# Altium project PuttPilot-Master.PrjPcb (part 2 of 4)

## Sheet ESP-Power.SchDoc: ESP Power
size 279 x 215 mm; DrawnBy: Ethan Abraham; Engineer: Ethan Abraham; Revision: 1.0; SheetNumber: 4; SheetTotal: 7
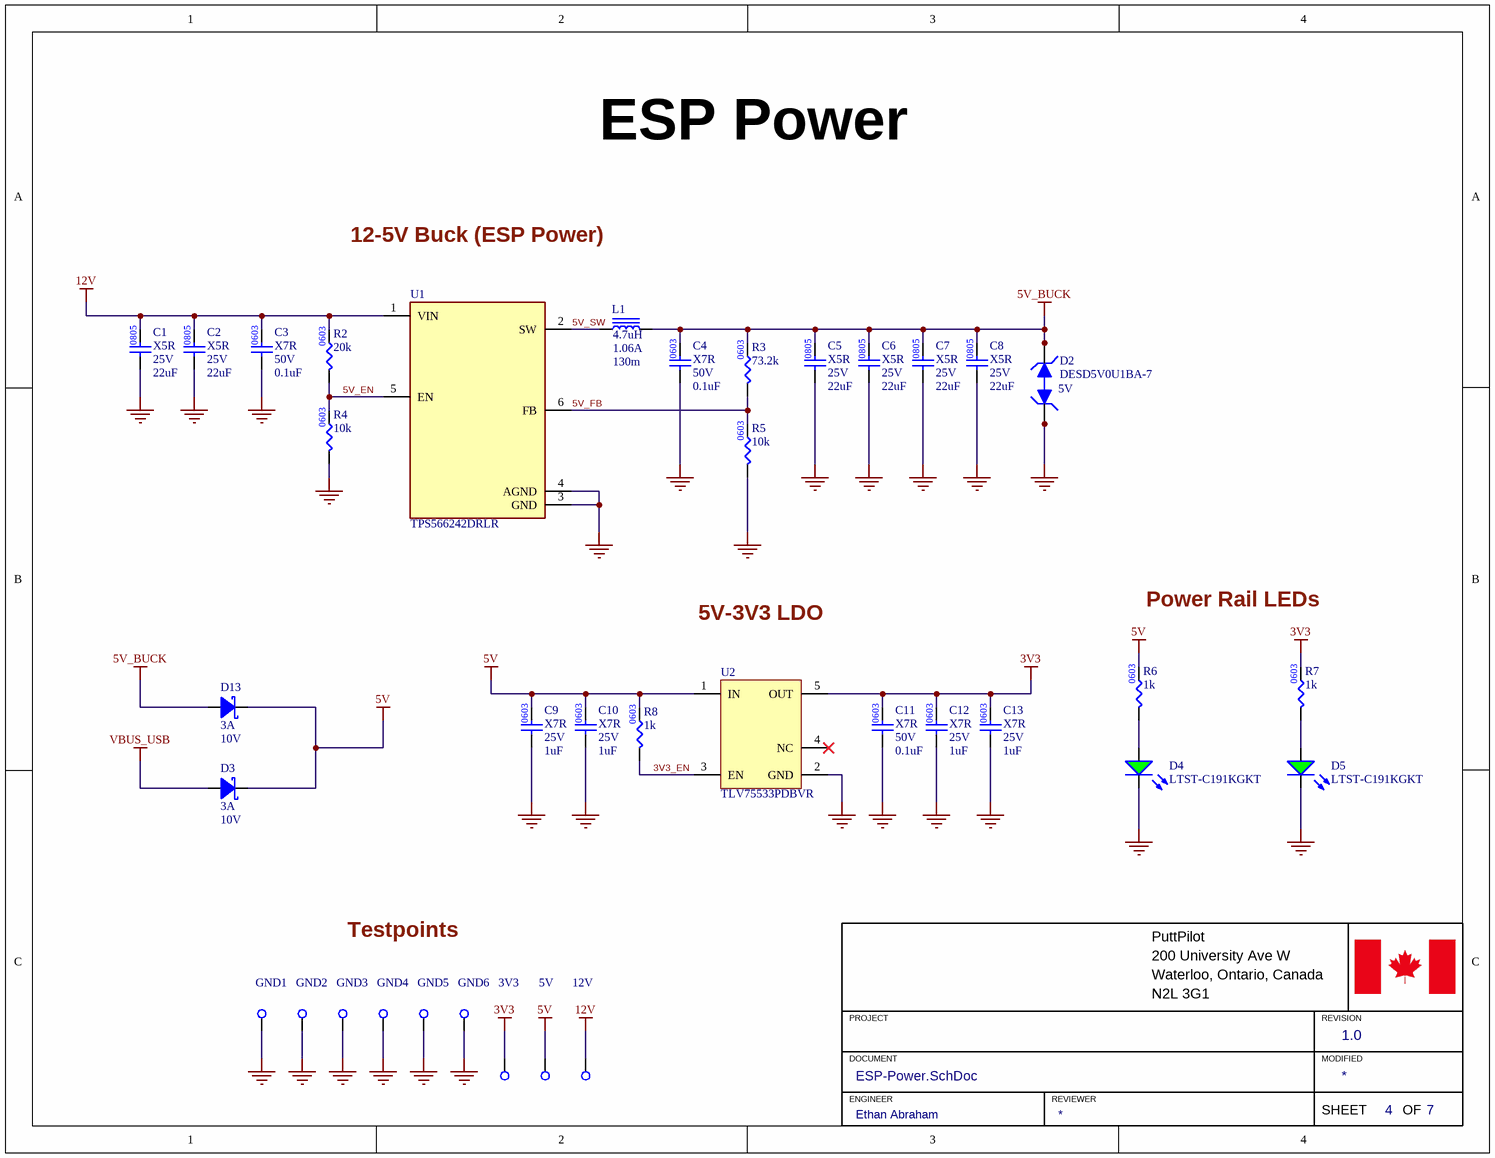
[diagram p4: ESP-Power.SchDoc]

### Parts
3V3  RCWCTE  [RCWCTE]  (value not drawn)
5V  RCWCTE  [RCWCTE]  (value not drawn)
12V  RCWCTE  [RCWCTE]  (value not drawn)
C1  Temperature Characteristics Code: X5R  Rated DC Voltage (URdc): 25V  Capacitance: 22uF  [.CAP_0805]  (hidden comment: GRM21BR61E226ME44K)
C2  Temperature Characteristics Code: X5R  Rated DC Voltage (URdc): 25V  Capacitance: 22uF  [.CAP_0805]  (hidden comment: GRM21BR61E226ME44K)
C3  Temperature Characteristics Code: X7R  Rated DC Voltage (URdc): 50V  Capacitance: 0.1uF  [.CAP_0603]  (hidden comment: GCJ188R71H104KA12D)
C4  Temperature Characteristics Code: X7R  Rated DC Voltage (URdc): 50V  Capacitance: 0.1uF  [.CAP_0603]  (hidden comment: GCJ188R71H104KA12D)
C5  Temperature Characteristics Code: X5R  Rated DC Voltage (URdc): 25V  Capacitance: 22uF  [.CAP_0805]  (hidden comment: GRM21BR61E226ME44K)
C6  Temperature Characteristics Code: X5R  Rated DC Voltage (URdc): 25V  Capacitance: 22uF  [.CAP_0805]  (hidden comment: GRM21BR61E226ME44K)
C7  Temperature Characteristics Code: X5R  Rated DC Voltage (URdc): 25V  Capacitance: 22uF  [.CAP_0805]  (hidden comment: GRM21BR61E226ME44K)
C8  Temperature Characteristics Code: X5R  Rated DC Voltage (URdc): 25V  Capacitance: 22uF  [.CAP_0805]  (hidden comment: GRM21BR61E226ME44K)
C9  Temperature Characteristics Code: X7R  Rated DC Voltage (URdc): 25V  Capacitance: 1uF  [.CAP_0603]  (hidden comment: GRT188R71E105KE13D)
C10  Temperature Characteristics Code: X7R  Rated DC Voltage (URdc): 25V  Capacitance: 1uF  [.CAP_0603]  (hidden comment: GRT188R71E105KE13D)
C11  Temperature Characteristics Code: X7R  Rated DC Voltage (URdc): 50V  Capacitance: 0.1uF  [.CAP_0603]  (hidden comment: GCJ188R71H104KA12D)
C12  Temperature Characteristics Code: X7R  Rated DC Voltage (URdc): 25V  Capacitance: 1uF  [.CAP_0603]  (hidden comment: GRT188R71E105KE13D)
C13  Temperature Characteristics Code: X7R  Rated DC Voltage (URdc): 25V  Capacitance: 1uF  [.CAP_0603]  (hidden comment: GRT188R71E105KE13D)
D2  DESD5V0U1BA-7  Rep Pk Reverse Voltage-Max: 5V  [DESD5V0U1BA-7]
D3  Max Current: 3A  Max Voltage: 10V  [BAT60JFILM]  (hidden comment: BAT60JFILM)
D4  LTST-C191KGKT  [.LED_0603]
D5  LTST-C191KGKT  [.LED_0603]
D13  Max Current: 3A  Max Voltage: 10V  [BAT60JFILM]  (hidden comment: BAT60JFILM)
GND1  RCWCTE  [RCWCTE]  (value not drawn)
GND2  RCWCTE  [RCWCTE]  (value not drawn)
GND3  RCWCTE  [RCWCTE]  (value not drawn)
GND4  RCWCTE  [RCWCTE]  (value not drawn)
GND5  RCWCTE  [RCWCTE]  (value not drawn)
GND6  RCWCTE  [RCWCTE]  (value not drawn)
L1  DC Resistance (DCR): 130m  Inductance-Nom (L): 4.7uH  Rated Current-Max: 1.06A  [NRH3012T4R7MN]  (hidden comment: NRH3012T4R7MN)
R2  Resistance: 20k  [.RES_0603]  (hidden comment: ERJ-3EKF2002V)
R3  Resistance: 73.2k  [.RES_0603]  (hidden comment: RC0603FR-0773K2L)
R4  Resistance: 10k  [.RES_0603]  (hidden comment: RC0603FR-0710KL)
R5  Resistance: 10k  [.RES_0603]  (hidden comment: RC0603FR-0710KL)
R6  Resistance: 1k  [.RES_0603]  (hidden comment: RC0603FR-071KL)
R7  Resistance: 1k  [.RES_0603]  (hidden comment: RC0603FR-071KL)
R8  Resistance: 1k  [.RES_0603]  (hidden comment: RC0603FR-071KL)
U1  TPS566242DRLR  [TPS566242DRLR]
U2  TLV75533PDBVR  [.SOT-23-5]

### Nets
3V3: 3V3.1 C11.2 C12.2 C13.2 R7.2 U2.5(OUT)
5V: 5V.1 C9.2 C10.2 D3.2(Cathode) D13.2(Cathode) R6.2 R8.2 U2.1(IN)
5V_BUCK: C4.2 C5.2 C6.2 C7.2 C8.2 D2.2(Pin_2) D13.1(Anode) L1.2 R3.2
12V: 12V.1 C1.2 C2.2 C3.2 R2.2 U1.1(VIN)
GND: C1.1 C2.1 C3.1 C4.1 C5.1 C6.1 C7.1 C8.1 C9.1 C10.1 C11.1 C12.1 C13.1 D2.1(Pin_1) D4.2(K) D5.2(K) GND1.1 GND2.1 GND3.1 GND4.1 GND5.1 GND6.1 R4.1 R5.1 U1.3(GND) U1.4(AGND) U2.2(GND)
VBUS_USB: D3.1(Anode)
3V3_EN: R8.1 U2.3(EN)
5V_EN: R2.1 R4.2 U1.5(EN)
5V_FB: R3.1 R5.2 U1.6(FB)
5V_SW: L1.1 U1.2(SW)
NetD4_1: D4.1(A) R6.1
NetD5_1: D5.1(A) R7.1

Not connected (* = marked no-connect by the designer): U2 4(NC)*

### Notes on the sheet
- 12-5V Buck (ESP Power)
- 5V-3V3 LDO
- Power Rail LEDs
- Testpoints
- PuttPilot
- 200 University Ave W
- PROJECT
- Waterloo, Ontario, Canada
- N2L 3G1
- REVISION
- DOCUMENT
- ENGINEER
- REVIEWER
- MODIFIED
- SHEET
- OF

### Library data of the parts
3V3 5V 12V GND1-GND6 = RCWCTE: SMT Test Point; Manufacturer: KOA Speer; Resistance: 0R; Current Rating: 2A; Number of Contacts: 1; Supplier 1: Digikey; Manufacturer Part Number: RCWCTE; RoHS: Yes; Category: Chip SMD Resistors; Stock 1: 56953; Pricing 1: 1=0.2, 10=0.15, 25=0.1344, 50=0.1238, 100=0.1141, 250=0.10268, 500=0.09488, 1000=0.08781 (USD); Mount: Surface Mount; Case/Package: 1206; Case Code (Imperial): 1206; Case Code (Metric): 3216; Contact Material: Copper,Tin; Min Operating Temperature: -55°C; Max Operating Temperature: 125°C; Packaging: Tape and Reel; Termination: SMD/SMT; Series: RC; Length: 3.2mm; Width: 1.6mm; Height: 2mm; Depth: 1.6mm; Military Standard: Not; RoHS Compliant: Yes; ComponentLink1URL: https://datasheet.ciiva.com/34302/1876186-34302940.pdf?src-supplier=Jameco; ComponentLink1Description: https://datasheet.ciiva.com/34302/1876186-34302940.pdf?src-supplier=Jameco; ComponentLink2URL: https://datasheet.ciiva.com/5556/rc-5556236.pdf?src-supplier=Mouser; ComponentLink2Description: https://datasheet.ciiva.com/5556/rc-5556236.pdf?src-supplier=Mouser; ComponentLink3URL: https://datasheet.ciiva.com/26821/getdatasheetpartid-110197-26821157.pdf?src-supplier=Verical; ComponentLink3Description: https://datasheet.ciiva.com/26821/getdatasheetpartid-110197-26821157.pdf?src-supplier=Verical; Supplier Part Number 1: 2019-RCWCTECT-ND
C1 C2 C5-C8 = GRM21BR61E226ME44K: CAP CER 22uF 25V X5R 0805; Manufacturer: Murata; Dielectric Material: Ceramic; Multilayer: Yes; Negative Tolerance: 20%; Supplier 1: Future Electronics; Manufacturer Part Number: GRM21BR61E226ME44K; RoHS: Yes; Category: Ceramic Capacitors; Stock 1: 60000; Pricing 1: 10000=0.0684, 20000=0.0672, 30000=0.0661 (USD); Mount: Surface Mount; Number of Pins: 2; Package Shape: Rectangular; Size Code: 0805; Terminal Finish: Nickel; Min Operating Temperature: -55°C; Max Operating Temperature: 85°C; JESD-609 Code: e3; Capacitor Type: Ceramic; Package Style: SMTMeter; Packaging: Tape and Reel; Positive Tolerance: 20%; Termination: Wraparound; Length: 2mm; Width: 1.25mm; Height: 1.25mm; Reach SVHC Compliant: Yes; RoHS Compliant: Yes; ComponentLink1URL: https://datasheet.ciiva.com:443/pdfs/VipMasterIC/IC/MURE/MURE-S-A0002977178/MURE-S-A0002978778-1.pdf?src-supplier=IHS+Markit; ComponentLink1Description: https://datasheet.ciiva.com:443/pdfs/VipMasterIC/IC/MURE/MURE-S-A0002977178/MURE-S-A0002978778-1.pdf?src-supplier=IHS+Markit; ComponentLink2URL: http://www.mouser.com/ds/2/281/c02e-2905.pdf?src-supplier=Mouser; ComponentLink2Description: http://www.mouser.com/ds/2/281/c02e-2905.pdf?src-supplier=Mouser; ComponentLink3URL: https://datasheet.octopart.com/GRM21BR61E226ME44K-Murata-datasheet-155345081.pdf?src-supplier=Element14; ComponentLink3Description: https://datasheet.octopart.com/GRM21BR61E226ME44K-Murata-datasheet-155345081.pdf?src-supplier=Element14; ComponentLink4URL: http://search.murata.co.jp/Ceramy/image/img/A01X/G101/ENG/GRM21BR61E226ME44-01.pdf?src-supplier=Digikey; ComponentLink4Description: http://search.murata.co.jp/Ceramy/image/img/A01X/G101/ENG/GRM21BR61E226ME44-01.pdf?src-supplier=Digikey; ComponentLink5URL: https://search.murata.co.jp/Ceramy/image/img/A01X/G101/ENG/GRM21BR61E226ME44-01.pdf?src-supplier=Digikey; ComponentLink5Description: https://search.murata.co.jp/Ceramy/image/img/A01X/G101/ENG/GRM21BR61E226ME44-01.pdf?src-supplier=Digikey; ComponentLink6URL: https://datasheet.octopart.com/GRM21BR61E226ME44K-Murata-datasheet-99353850.pdf?src-supplier=Future+Electronics; ComponentLink6Description: https://datasheet.octopart.com/GRM21BR61E226ME44K-Murata-datasheet-99353850.pdf?src-supplier=Future+Electronics; ComponentLink7URL: https://datasheet.octopart.com/GRM21BR61E226ME44K-Murata-datasheet-155345081.pdf?src-supplier=Newark; ComponentLink7Description: https://datasheet.octopart.com/GRM21BR61E226ME44K-Murata-datasheet-155345081.pdf?src-supplier=Newark; ComponentLink8URL: https://datasheet.octopart.com/GRM21BR61E226ME44K-Murata-datasheet-165579666.pdf?src-supplier=TME; ComponentLink8Description: https://datasheet.octopart.com/GRM21BR61E226ME44K-Murata-datasheet-165579666.pdf?src-supplier=TME; Supplier Part Number 1: 1092989
C3 C4 C11 = GCJ188R71H104KA12D: CAP CER 0.1uF 50V X7R 0603; Manufacturer: Murata; Dielectric Material: Ceramic; Multilayer: Yes; Negative Tolerance: 10%; Reference Standard: AEC-Q200; Supplier 1: Future Electronics; Manufacturer Part Number: GCJ188R71H104KA12D; RoHS: Yes; Category: Ceramic Capacitors; Stock 1: 3280000; Pricing 1: 4000=0.0182, 12000=0.0178, 20000=0.0176, 80000=0.017, 120000=0.0167 (USD); Mount: Surface Mount; Number of Pins: 2; Package Shape: Rectangular; Size Code: 0603; Terminal Finish: Nickel; Min Operating Temperature: -55°C; Max Operating Temperature: 125°C; JESD-609 Code: e3; Capacitor Type: Ceramic; Package Style: SMTMeter; Packaging: Tape and Reel; Positive Tolerance: 10%; Termination: Wraparound; Length: 1.6mm; Width: 0.8mm; Height: 0.8mm; Reach SVHC Compliant: Yes; RoHS Compliant: Yes; ComponentLink1URL: https://psearch.en.murata.com:443/capacitor/product/GCJ188R71H104KA12%23.pdf?src-supplier=IHS+Markit; ComponentLink1Description: https://psearch.en.murata.com:443/capacitor/product/GCJ188R71H104KA12%23.pdf?src-supplier=IHS+Markit; ComponentLink2URL: https://datasheet.ciiva.com/135/product-135604.pdf?src-supplier=Digikey; ComponentLink2Description: https://datasheet.ciiva.com/135/product-135604.pdf?src-supplier=Digikey; ComponentLink3URL: https://datasheet.ciiva.com/26889/getdatasheetpartid-369886-26889118.pdf?src-supplier=Verical; ComponentLink3Description: https://datasheet.ciiva.com/26889/getdatasheetpartid-369886-26889118.pdf?src-supplier=Verical; ComponentLink4URL: https://datasheet.ciiva.com/135/s0717e-135605.pdf?src-supplier=Digikey; ComponentLink4Description: https://datasheet.ciiva.com/135/s0717e-135605.pdf?src-supplier=Digikey; ComponentLink5URL: https://datasheet.ciiva.com/135/s0717e-135606.pdf?src-supplier=Digikey; ComponentLink5Description: https://datasheet.ciiva.com/135/s0717e-135606.pdf?src-supplier=Digikey; ComponentLink6URL: https://datasheet.ciiva.com/16440/c03e-16440425.pdf?src-supplier=Future+Electronics; ComponentLink6Description: https://datasheet.ciiva.com/16440/c03e-16440425.pdf?src-supplier=Future+Electronics; Supplier Part Number 1: 1158604
C9 C10 C12 C13 = GRT188R71E105KE13D: CAP CER 1uF 25V X7R 0603; Manufacturer: Murata; Dielectric Material: Ceramic; Multilayer: Yes; Negative Tolerance: 10%; Reference Standard: AEC-Q200; Supplier 1: Future Electronics; Manufacturer Part Number: GRT188R71E105KE13D; RoHS: Yes; Category: Ceramic Capacitors; Stock 1: 236000; Pricing 1: 4000=0.0164, 12000=0.0158, 20000=0.0155, 80000=0.0148, 120000=0.0144 (USD); Mount: Surface Mount; Number of Pins: 2; Package Shape: Rectangular; Size Code: 0603; Terminal Finish: Nickel; Min Operating Temperature: -55°C; Max Operating Temperature: 125°C; JESD-609 Code: e3; Capacitor Type: Ceramic; Packaging: Tape and Reel; Positive Tolerance: 10%; Termination: Wraparound; Reach SVHC Compliant: Yes; RoHS Compliant: Yes; ComponentLink1URL: https://datasheet.ciiva.com:443/pdfs/VipMasterIC/IC/MURE/MURE-S-A0004410517/MURE-S-A0004413605-1.pdf?src-supplier=IHS+Markit; ComponentLink1Description: https://datasheet.ciiva.com:443/pdfs/VipMasterIC/IC/MURE/MURE-S-A0004410517/MURE-S-A0004413605-1.pdf?src-supplier=IHS+Markit; ComponentLink2URL: http://www.farnell.com/datasheets/2165962.pdf?src-supplier=Farnell; ComponentLink2Description: http://www.farnell.com/datasheets/2165962.pdf?src-supplier=Farnell; ComponentLink3URL: https://datasheet.octopart.com/GRT188R71E105KE13D-Murata-datasheet-149523601.pdf?src-supplier=Farnell; ComponentLink3Description: https://datasheet.octopart.com/GRT188R71E105KE13D-Murata-datasheet-149523601.pdf?src-supplier=Farnell; ComponentLink4URL: https://datasheet.octopart.com/GRT188R71E105KE13D-Murata-datasheet-67697754.pdf?src-supplier=Newark; ComponentLink4Description: https://datasheet.octopart.com/GRT188R71E105KE13D-Murata-datasheet-67697754.pdf?src-supplier=Newark; ComponentLink5URL: https://datasheet.octopart.com/GRT188R71E105KE13D-Murata-datasheet-165579666.pdf?src-supplier=TME; ComponentLink5Description: https://datasheet.octopart.com/GRT188R71E105KE13D-Murata-datasheet-165579666.pdf?src-supplier=TME; Supplier Part Number 1: 6183026
D2 = DESD5V0U1BA-7: TVS DIODE 5VWM; Manufacturer: Diodes; Diode Element Material: SILICON; Package Body Material: Plastic; Polarity: Bidirectional; Max Breakdown Voltage: 9.5V; Min Breakdown Voltage: 5.5V; Diode Type: TRANS VOLTAGE SUPPRESSOR; Number of Elements: 1; Max Power Dissipation: 250mW; Reference Standard: IEC-61000-4-2; Supplier 1: Future Electronics; Manufacturer Part Number: DESD5V0U1BA-7; RoHS: Yes; Category: TVS Diodes; Stock 1: 54000; Pricing 1: 3000=0.0283, 12000=0.0271, 30000=0.0263, 75000=0.0256, 120000=0.0244 (USD); Number of Pins: 2; Package Shape: Rectangular; Min Operating Temperature: -65°C; Max Operating Temperature: 150°C; JESD-30 Code: R-PDSO-G2; Package Style: SMALL OUTLINEMeter; Surface Mount: Yes; Technology: AVALANCHE; Terminal Form: Gull Wing; Terminal Position: DUAL; Reach SVHC Compliant: Yes; RoHS Compliant: Yes; ComponentLink1URL: https://datasheet.ciiva.com:443/pdfs/VipMasterIC/IC/DIOD/DIOD-S-A0002833665/DIOD-S-A0002833261-1.pdf?src-supplier=IHS+Markit; ComponentLink1Description: https://datasheet.ciiva.com:443/pdfs/VipMasterIC/IC/DIOD/DIOD-S-A0002833665/DIOD-S-A0002833261-1.pdf?src-supplier=IHS+Markit; ComponentLink2URL: http://www.farnell.com/datasheets/2814368.pdf?src-supplier=Farnell; ComponentLink2Description: http://www.farnell.com/datasheets/2814368.pdf?src-supplier=Farnell; ComponentLink3URL: http://www.mouser.com/ds/2/115/DESD5V0U1BA-756900.pdf?src-supplier=Mouser; ComponentLink3Description: http://www.mouser.com/ds/2/115/DESD5V0U1BA-756900.pdf?src-supplier=Mouser; ComponentLink4URL: http://www.farnell.com/datasheets/2814368.pdf?src-supplier=Element14; ComponentLink4Description: http://www.farnell.com/datasheets/2814368.pdf?src-supplier=Element14; ComponentLink5URL: http://www.farnell.com/datasheets/2814368.pdf?src-supplier=Newark; ComponentLink5Description: http://www.farnell.com/datasheets/2814368.pdf?src-supplier=Newark; ComponentLink6URL: https://www.diodes.com/assets/Datasheets/DESD5V0U1BA.pdf?src-supplier=Digikey; ComponentLink6Description: https://www.diodes.com/assets/Datasheets/DESD5V0U1BA.pdf?src-supplier=Digikey; Supplier Part Number 1: 8076210
D3 D13 = BAT60JFILM: DIODE SCHOTTKY 10V 3A SOD323
D4 D5 = LTST-C191KGKT: LED GREEN 2V 0603; Manufacturer: Vishay Lite-On; Shape: Rectangular; Lens Style: WATER CLEAR; Forward Current-Max: 30mA; Luminous Intensity-Nom: 35mcd; Number of Functions: 1; Optoelectronic Device Type: SINGLE COLOR LED; Viewing Angle: 130°; Forward Voltage-Max: 2.4V; Reverse Voltage-Max: 5V; Overall Height: 0.55mm; Supplier 1: Digikey; Manufacturer Part Number: LTST-C191KGKT; RoHS: Yes; Stock 1: 171853; Pricing 1: 1=0.22, 10=0.121, 100=0.0721, 500=0.05324, 1000=0.04748, 2000=0.04278 (USD); Mount: Surface Mount; Number of Pins: 2; Color: Green; Color@wavelength: Green; Terminal Finish: Tin; Min Operating Temperature: -55°C; Max Operating Temperature: 85°C; Packaging: Tape and Reel; JESD-609 Code: e3; Size: 1.1mm; Terminal Pitch: 1.5mm; Reach SVHC Compliant: Yes; RoHS Compliant: Yes; ComponentLink1URL: https://datasheet.ciiva.com:443/pdfs/VipMasterIC/IC/LITE/LITE-S-A0003156116/LITE-S-A0003156116-1.pdf?src-supplier=IHS+Markit; ComponentLink1Description: https://datasheet.ciiva.com:443/pdfs/VipMasterIC/IC/LITE/LITE-S-A0003156116/LITE-S-A0003156116-1.pdf?src-supplier=IHS+Markit; ComponentLink2URL: https://datasheet.ciiva.com/2109/ltst-c191kgkt-2109973.pdf?src-supplier=Digikey; ComponentLink2Description: https://datasheet.ciiva.com/2109/ltst-c191kgkt-2109973.pdf?src-supplier=Digikey; Supplier Part Number 1: 160-1446-1-ND
L1 = NRH3012T4R7MN: FIXED IND 4.7uH 1.06A; Manufacturer: Taiyo Yuden; Core Material: Ferrite; Tolerance: 20%; Inductor Type: GENERAL PURPOSE INDUCTOR; Case/Size Code: 1212; Inductor Application: POWER INDUCTOR; Number of Functions: 1; Self Resonant Frequency: 50MHz; Shape/Size Description: RECTANGULAR PACKAGE; Shielding: Shielded; Test Frequency: 100kHz; Package Height: 1.2mm; Package Length: 3mm; Supplier 1: Digikey; Manufacturer Part Number: NRH3012T4R7MN; RoHS: Yes; Category: Fixed Inductors; Stock 1: 136715; Pricing 1: 1=0.22, 10=0.174, 25=0.1572, 50=0.1458, 100=0.1351, 250=0.12216, 500=0.1132, 1000=0.10487 (USD); Number of Pins: 2; Min Operating Temperature: -25°C; Max Operating Temperature: 120°C; Construction: Chip; Package Style: SMTMeter; Packaging: Tape and Reel; Surface Mount: Yes; Terminal Placement: Dual Ended; Termination: One Surface; Package Width: 3mm; Reach SVHC Compliant: Yes; RoHS Compliant: Yes; ComponentLink1URL: https://datasheet.ciiva.com:443/pdfs/VipMasterIC/IC/TAIY/TAIY-S-A0009100136/TAIY-S-A0009100438-1.pdf?src-supplier=IHS+Markit; ComponentLink1Description: https://datasheet.ciiva.com:443/pdfs/VipMasterIC/IC/TAIY/TAIY-S-A0009100136/TAIY-S-A0009100438-1.pdf?src-supplier=IHS+Markit; ComponentLink2URL: https://datasheet.ciiva.com/6689/nrh3012t4r7mn-ss-6689125.pdf?src-supplier=Digikey; ComponentLink2Description: https://datasheet.ciiva.com/6689/nrh3012t4r7mn-ss-6689125.pdf?src-supplier=Digikey; ComponentLink3URL: https://datasheet.ciiva.com/25607/0900766b810b3cd2-25607859.pdf?src-supplier=Rs; ComponentLink3Description: https://datasheet.ciiva.com/25607/0900766b810b3cd2-25607859.pdf?src-supplier=Rs; ComponentLink4URL: https://datasheet.ciiva.com/8502/nrh3012t4r7mn-ss-8502637.pdf?src-supplier=Avnet; ComponentLink4Description: https://datasheet.ciiva.com/8502/nrh3012t4r7mn-ss-8502637.pdf?src-supplier=Avnet; ComponentLink5URL: https://datasheet.ciiva.com/8002/wound04-e-8002198.pdf?src-supplier=Element14; ComponentLink5Description: https://datasheet.ciiva.com/8002/wound04-e-8002198.pdf?src-supplier=Element14; Supplier Part Number 1: 587-2591-1-ND
R2 = ERJ-3EKF2002V: RES 20K OHM 0603; Manufacturer: Panasonic; Tolerance: 1%; Rated Power Dissipation (P): 100mW; Rated Temperature: 70°C; Temperature Coefficient: 100ppm/°C; Working Voltage: 75V; Package Height: 0.45mm; Package Length: 1.6mm; Package Width: 0.8mm; Reference Standard: AEC-Q200; Supplier 1: Mouser; Manufacturer Part Number: ERJ-3EKF2002V; RoHS: Yes; Category: Chip SMD Resistors; Stock 1: 221599; Pricing 1: 1=0.1, 10=0.02, 50=0.02, 100=0.012, 1000=0.009, 5000=0.005, 10000=0.005, 25000=0.004 (USD); Mount: Surface Mount; Number of Pins: 2; Package Shape: Rectangular; Size Code: 0603; Terminal Finish: Nickel; Min Operating Temperature: -55°C; Max Operating Temperature: 155°C; JESD-609 Code: e3; Resistor Type: FIXED RESISTOR; Construction: Rectangular; Package Style: SMTMeter; Packaging: Tape and Reel; Technology: METAL GLAZE/THICK FILM; Termination: Wraparound; RoHS Compliant: Yes; Reach SVHC Compliant: Yes; ComponentLink1URL: https://datasheet.ciiva.com:443/pdfs/VipMasterIC/IC/PANA/PANA-S-A0009889626/PANA-S-A0009889626-1.pdf?src-supplier=IHS+Markit; ComponentLink1Description: https://datasheet.ciiva.com:443/pdfs/VipMasterIC/IC/PANA/PANA-S-A0009889626/PANA-S-A0009889626-1.pdf?src-supplier=IHS+Markit; ComponentLink2URL: https://datasheet.ciiva.com/15158/getdatasheetpartid-248555-15158987.pdf?src-supplier=Verical; ComponentLink2Description: https://datasheet.ciiva.com/15158/getdatasheetpartid-248555-15158987.pdf?src-supplier=Verical; ComponentLink3URL: https://datasheet.ciiva.com/28688/1678782-28688604.pdf?src-supplier=Element14; ComponentLink3Description: https://datasheet.ciiva.com/28688/1678782-28688604.pdf?src-supplier=Element14; ComponentLink4URL: https://datasheet.ciiva.com/46377/1678782-46377365.pdf?src-supplier=Element14; ComponentLink4Description: https://datasheet.ciiva.com/46377/1678782-46377365.pdf?src-supplier=Element14; ComponentLink5URL: https://datasheet.ciiva.com/22749/1678782-22749661.pdf?src-supplier=Element14; ComponentLink5Description: https://datasheet.ciiva.com/22749/1678782-22749661.pdf?src-supplier=Element14; ComponentLink6URL: https://datasheet.ciiva.com/30218/aoa0000ce2-30218069.pdf?src-supplier=Onlinecomponents.com; ComponentLink6Description: https://datasheet.ciiva.com/30218/aoa0000ce2-30218069.pdf?src-supplier=Onlinecomponents.com; Supplier Part Number 1: 667-ERJ-3EKF2002V
R3 = RC0603FR-0773K2L: RES 73.2K OHM 0603; Manufacturer: Yageo; Tolerance: 1%; Additional Feature: LASER TRIMMABLE; Rated Power Dissipation (P): 100mW; Rated Temperature: 70°C; Temperature Coefficient: 100ppm/°C; Working Voltage: 75V; Package Height: 0.45mm; Package Length: 1.6mm; Package Width: 0.8mm; Supplier 1: Future Electronics; Manufacturer Part Number: RC0603FR-0773K2L; RoHS: Yes; Category: Chip SMD Resistors; Stock 1: 125000; Pricing 1: 5000=0.0026, 50000=0.0025, 150000=0.0024, 375000=0.0023, 1000000=0.0022 (USD); Mount: Surface Mount; Number of Pins: 2; Package Shape: Rectangular; Size Code: 0603; Terminal Finish: Nickel; Min Operating Temperature: -55°C; Max Operating Temperature: 155°C; JESD-609 Code: e3; Resistor Type: FIXED RESISTOR; Construction: Chip; Package Style: SMTMeter; Packaging: Tape and Reel; Technology: METAL GLAZE/THICK FILM; Termination: Wraparound; Reach SVHC Compliant: Yes; RoHS Compliant: Yes; ComponentLink1URL: https://datasheet.ciiva.com:443/pdfs/VipMasterIC/IC/YAGO/YAGO-S-A0008145938/YAGO-S-A0008145938-1.pdf?src-supplier=IHS+Markit; ComponentLink1Description: https://datasheet.ciiva.com:443/pdfs/VipMasterIC/IC/YAGO/YAGO-S-A0008145938/YAGO-S-A0008145938-1.pdf?src-supplier=IHS+Markit; ComponentLink2URL: https://datasheet.ciiva.com/8888/pyu-rc0603-51-rohs-l-4-8888325.pdf?src-supplier=Avnet; ComponentLink2Description: https://datasheet.ciiva.com/8888/pyu-rc0603-51-rohs-l-4-8888325.pdf?src-supplier=Avnet; Supplier Part Number 1: 8036170
R4 R5 = RC0603FR-0710KL: RES 10K OHM 0603; Manufacturer: Yageo; Tolerance: 1%; Additional Feature: LASER TRIMMABLE; Rated Power Dissipation (P): 100mW; Rated Temperature: 70°C; Temperature Coefficient: 100ppm/°C; Working Voltage: 75V; Package Height: 0.45mm; Package Length: 1.6mm; Package Width: 0.8mm; Supplier 1: Future Electronics; Manufacturer Part Number: RC0603FR-0710KL; RoHS: Yes; Category: Chip SMD Resistors; Stock 1: 30355000; Pricing 1: 5000=0.0026, 50000=0.0025, 150000=0.0024, 375000=0.0023, 1000000=0.0022 (USD); Mount: Surface Mount; Number of Pins: 2; Package Shape: Rectangular; Size Code: 0603; Terminal Finish: Nickel; Min Operating Temperature: -55°C; Max Operating Temperature: 155°C; JESD-609 Code: e3; Resistor Type: FIXED RESISTOR; Construction: Chip; Package Style: SMTMeter; Packaging: Tape and Reel; Technology: METAL GLAZE/THICK FILM; Termination: Wraparound; Reach SVHC Compliant: Yes; RoHS Compliant: Yes; ComponentLink1URL: https://datasheet.ciiva.com:443/pdfs/VipMasterIC/IC/YAGO/YAGO-S-A0008145938/YAGO-S-A0008145938-1.pdf?src-supplier=IHS+Markit; ComponentLink1Description: https://datasheet.ciiva.com:443/pdfs/VipMasterIC/IC/YAGO/YAGO-S-A0008145938/YAGO-S-A0008145938-1.pdf?src-supplier=IHS+Markit; ComponentLink2URL: https://datasheet.ciiva.com/22747/443971-22747519.pdf?src-supplier=Element14; ComponentLink2Description: https://datasheet.ciiva.com/22747/443971-22747519.pdf?src-supplier=Element14; ComponentLink3URL: https://datasheet.ciiva.com/46440/1868787-46440891.pdf?src-supplier=Element14; ComponentLink3Description: https://datasheet.ciiva.com/46440/1868787-46440891.pdf?src-supplier=Element14; ComponentLink4URL: https://datasheet.ciiva.com/15189/getdatasheetpartid-409289-15189591.pdf?src-supplier=Verical; ComponentLink4Description: https://datasheet.ciiva.com/15189/getdatasheetpartid-409289-15189591.pdf?src-supplier=Verical; ComponentLink5URL: https://datasheet.ciiva.com/7660/38590-7660789.pdf?src-supplier=Element14; ComponentLink5Description: https://datasheet.ciiva.com/7660/38590-7660789.pdf?src-supplier=Element14; ComponentLink6URL: https://datasheet.ciiva.com/7746/1738695-7746239.pdf?src-supplier=Element14; ComponentLink6Description: https://datasheet.ciiva.com/7746/1738695-7746239.pdf?src-supplier=Element14; ComponentLink7URL: https://datasheet.ciiva.com/7983/443971-7983596.pdf?src-supplier=Element14; ComponentLink7Description: https://datasheet.ciiva.com/7983/443971-7983596.pdf?src-supplier=Element14; Supplier Part Number 1: 4023214
R6-R8 = RC0603FR-071KL: RES 1K OHM 0603; Manufacturer: Yageo; Tolerance: 1%; Additional Feature: LASER TRIMMABLE; Rated Power Dissipation (P): 100mW; Rated Temperature: 70°C; Temperature Coefficient: 100ppm/°C; Working Voltage: 75V; Package Height: 0.45mm; Package Length: 1.6mm; Package Width: 0.8mm; Supplier 1: Future Electronics; Manufacturer Part Number: RC0603FR-071KL; RoHS: Yes; Category: Chip SMD Resistors; Stock 1: 12810000; Pricing 1: 5000=0.0026, 50000=0.0025, 150000=0.0024, 375000=0.0023, 1000000=0.0022 (USD); Mount: Surface Mount; Number of Pins: 2; Package Shape: Rectangular; Size Code: 0603; Terminal Finish: Nickel; Min Operating Temperature: -55°C; Max Operating Temperature: 155°C; JESD-609 Code: e3; Resistor Type: FIXED RESISTOR; Construction: Chip; Package Style: SMTMeter; Packaging: Tape and Reel; Technology: METAL GLAZE/THICK FILM; Termination: Wraparound; Reach SVHC Compliant: Yes; RoHS Compliant: Yes; ComponentLink1URL: https://datasheet.ciiva.com:443/pdfs/VipMasterIC/IC/YAGO/YAGO-S-A0008145938/YAGO-S-A0008145938-1.pdf?src-supplier=IHS+Markit; ComponentLink1Description: https://datasheet.ciiva.com:443/pdfs/VipMasterIC/IC/YAGO/YAGO-S-A0008145938/YAGO-S-A0008145938-1.pdf?src-supplier=IHS+Markit; ComponentLink2URL: https://datasheet.ciiva.com/11808/0900766b80f96399-11808081.pdf?src-supplier=Rs; ComponentLink2Description: https://datasheet.ciiva.com/11808/0900766b80f96399-11808081.pdf?src-supplier=Rs; ComponentLink3URL: https://datasheet.ciiva.com/8896/pyu-rc0603-51-rohs-l-4-8896106.pdf?src-supplier=Avnet; ComponentLink3Description: https://datasheet.ciiva.com/8896/pyu-rc0603-51-rohs-l-4-8896106.pdf?src-supplier=Avnet; ComponentLink4URL: https://datasheet.ciiva.com/7660/1868787-7660790.pdf?src-supplier=Element14; ComponentLink4Description: https://datasheet.ciiva.com/7660/1868787-7660790.pdf?src-supplier=Element14; ComponentLink5URL: https://datasheet.ciiva.com/7746/1738695-7746279.pdf?src-supplier=Element14; ComponentLink5Description: https://datasheet.ciiva.com/7746/1738695-7746279.pdf?src-supplier=Element14; ComponentLink6URL: https://datasheet.ciiva.com/7746/1686128-7746280.pdf?src-supplier=Element14; ComponentLink6Description: https://datasheet.ciiva.com/7746/1686128-7746280.pdf?src-supplier=Element14; ComponentLink7URL: https://datasheet.ciiva.com/7746/1738695-7746281.pdf?src-supplier=Element14; ComponentLink7Description: https://datasheet.ciiva.com/7746/1738695-7746281.pdf?src-supplier=Element14; ComponentLink8URL: https://datasheet.ciiva.com/7983/443971-7983613.pdf?src-supplier=Element14; ComponentLink8Description: https://datasheet.ciiva.com/7983/443971-7983613.pdf?src-supplier=Element14; ComponentLink9URL: https://datasheet.ciiva.com/15189/getdatasheetpartid-404327-15189644.pdf?src-supplier=Verical; ComponentLink9Description: https://datasheet.ciiva.com/15189/getdatasheetpartid-404327-15189644.pdf?src-supplier=Verical; Supplier Part Number 1: 4016291
U1 = TPS566242DRLR: BUCK 3V-16V 6A SOT-563; Manufacturer: Texas Instruments; Supplier 1: Mouser; Manufacturer Part Number: TPS566242DRLR; RoHS: No; Category: Voltage Regulators - Switching; Stock 1: 5599; Pricing 1: 1=0.77, 10=0.667, 50=0.667, 100=0.511, 1000=0.324, 10000=0.259 (USD); Supplier Part Number 1: 595-TPS566242DRLR
U2 = TLV75533PDBVR: 3V3 (Fixed) LDO 500mA SOT25; Manufacturer: Texas Instruments; Output Voltage: 3.3V; Supplier 1: Mouser; Manufacturer Part Number: TLV75533PDBVR; ComponentLink1URL: https://www.ti.com:443/lit/ds/symlink/tlv755p.pdf?src-supplier=IHS+Markit; ComponentLink1Description: https://www.ti.com:443/lit/ds/symlink/tlv755p.pdf?src-supplier=IHS+Markit; ComponentLink2URL: http://www.ti.com/lit/ds/symlink/tlv755p.pdf?src-supplier=Digikey; ComponentLink2Description: http://www.ti.com/lit/ds/symlink/tlv755p.pdf?src-supplier=Digikey; ComponentLink3URL: http://www.ti.com/general/docs/suppproductinfo.tsp?distId=10&amp;gotoUrl=http%3A%2F%2Fwww.ti.com%2Flit%2Fgpn%2Ftlv755p&src-supplier=Digikey; ComponentLink3Description: http://www.ti.com/general/docs/suppproductinfo.tsp?distId=10&amp;gotoUrl=http%3A%2F%2Fwww.ti.com%2Flit%2Fgpn%2Ftlv755p&src-supplier=Digikey; Supplier Part Number 1: 595-TLV75533PDBVR; Max Output Current: 500mA; Package: SOT-23-5